# EasyEDA Pro project 18650Charger.epro

# Schematic Schematic1
Create Date: 2022-09-24; Page Name: P1; Project Name: 18650锂电池充电模块; Schematic Name: Schematic1; Update Date: 2022-10-14; Company: 嘉立创EDA
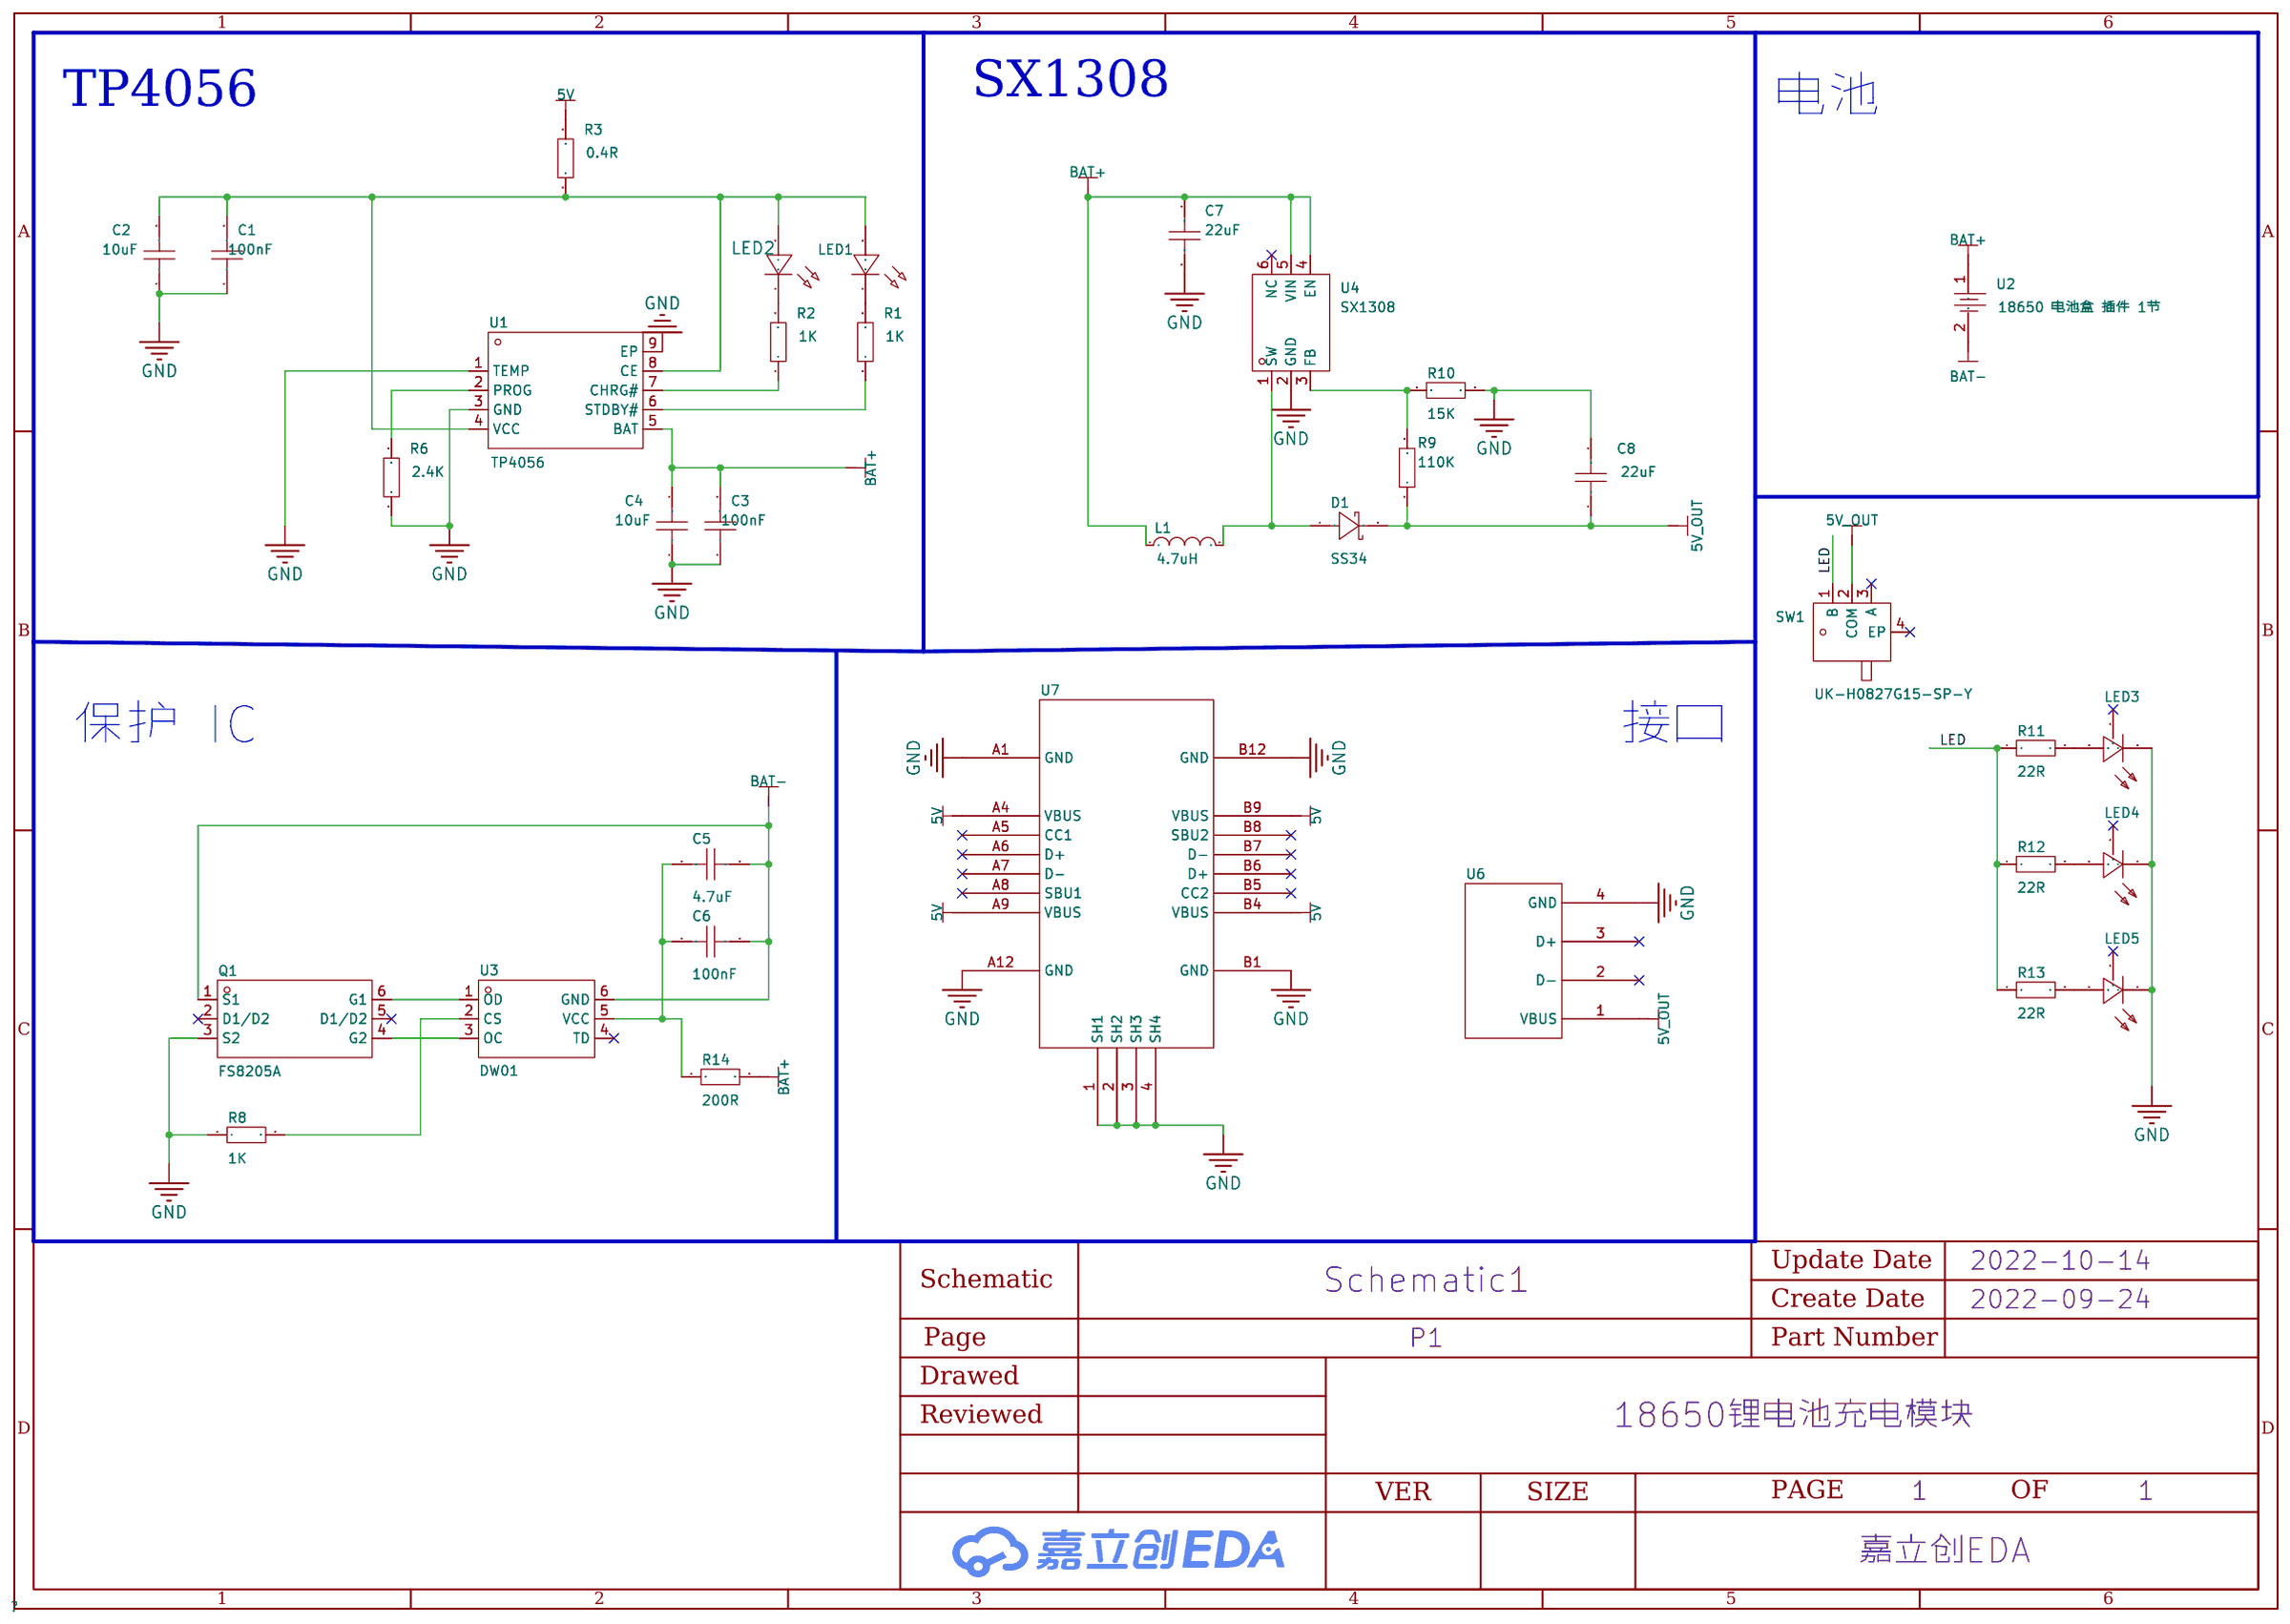
[diagram p0: schematic sheet]

## Parts
C1  100nF  [C0805]
C2  100nF  [C0805]
C3  100nF  [C0805]
C4  100nF  [C0805]
C5  100nF  [C0603]
C6  100nF  [C0603]
C7  100nF  [C0603]
C8  100nF  [C0603]
D1  SS34  [SMA_L4.3-W2.5-LS5.0-FD]
L1  4.7uH  [IND-SMD_L7.4-W6.6]
LED1  -  [LED0805-RD_RED]
LED2  -  [LED0805-RD_RED]
LED3  HL-A-5730D34W-S1-08-HR3(LY)  [LED-SMD_3P-L5.7-W3.0-RD]
LED4  HL-A-5730D34W-S1-08-HR3(LY)  [LED-SMD_3P-L5.7-W3.0-RD]
LED5  HL-A-5730D34W-S1-08-HR3(LY)  [LED-SMD_3P-L5.7-W3.0-RD]
Q1  FS8205A  [SOT-23-6_L2.9-W1.6-P0.95-LS2.8-BR]
R1  10K  [R0603]
R2  10K  [R0603]
R3  10K  [R0603]
R6  10K  [R0603]
R8  10K  [R0603]
R9  10K  [R0603]
R10  10K  [R0603]
R11  10K  [R0603]
R12  10K  [R0603]
R13  10K  [R0603]
R14  10K  [R0603]
SW1  UK-H0827G15-SP-Y  [SW-SMD_UK-H0827G15-SP-Y]
U1  TP4056  [ESOP-8_L4.9-W3.9-P1.27-LS6.0-BL-EP]
U2  18650 电池盒 插件 1节  [BAT-TH_18650-C9900004923]
U3  DW01  [SOT-23-6_L2.9-W1.6-P0.95-LS2.8-BR]
U4  SX1308  [SOT-23-6_L2.9-W1.6-P0.95-LS2.8-BR]
U6  -  [USB-A Short]
U7  -  [TypeC-16p]

## Library data of the parts
C1-C4 = CAP_0805: 容值:100nF;精度:±10%;额定电压:50V;温度系数:X7R;; Supplier Footprint: 0805
C5-C8 = CAP_0603: Supplier Footprint: 0603
D1 = SS34: 二极管配置:独立式;直流反向耐压(Vr):40V;平均整流电流(Io):3A;正向压降(Vf):550mV@3A;反向电流(Ir):500A@40V;; LCSC Part Name: 40V 3A 550mV@3A; Supplier Part: C2931787; Manufacturer: Doeshare(德芯); Supplier Footprint: SMA; JLCPCB Part Class: 扩展库; Datasheet: https://atta.szlcsc.com/upload/public/pdf/source/20220105/EDEF617DBB50E389FEB58D03748E8B49.pdf; Supplier: LCSC; Diode Configuration: 独立式; Reverse Voltage (Vr): 40V; Average Rectified Current (Io): 3A; Forward Voltage (Vf@If): 550mV@3A; Reverse Leakage Current (Ir): 500A@40V
L1 = CKST0603-4.7uH/M: LCSC Part Name: SMD 一体贴片电感4.7uH±20%; Supplier Part: C3002636; Manufacturer: CENKER(岑科); Supplier Footprint: SMD,7.4x6.6x3mm; JLCPCB Part Class: 扩展库; Datasheet: https://atta.szlcsc.com/upload/public/pdf/source/20220510/B48FE89972EB9627500571FF6CB43AFA.pdf; Supplier: LCSC
LED1 = LED_0805-G: Supplier Footprint: 0805
LED2 = LED_0805-R: Supplier Footprint: 0805
LED3-LED5 = HL-A-5730D34W-S1-08-HR3(LY): 发光颜色:白灯;二极管配置:-;透镜颜色:雾状黄;主波长:-;峰值波长:-;色温:-;光通量(25时):-;测试电流:-;正向电压(VF):-;发光强度:-;功率:612mW;发光角度:120°;安装方式:正贴;工作温度:-40~+85;; LCSC Part Name: 白灯 正贴; Supplier Part: C210354; Manufacturer: HONGLITRONIC(鸿利光电); Supplier Footprint: 5730(mm); JLCPCB Part Class: 扩展库; Datasheet: https://atta.szlcsc.com/upload/public/pdf/source/20200902/C210350_91D2B1C221EBF980B384078881E60407.pdf; Supplier: LCSC; Emitted Color: 白灯; Lens Color: 雾状黄; Power Dissipation: 612mW; Viewing Angle: 120°; Mounting Sytle: 正贴; Operating Temperature: -40~+85
Q1 = FS8205A: 类型:2个N沟道;漏源电压(Vdss):20V;连续漏极电流(Id):6A;功率(Pd):1.5W;导通电阻(RDS(on)@Vgs,Id):19.5mΩ@4.5V,3A;阈值电压(Vgs(th)@Id):700mV@250uA;栅极电荷(Qg@Vgs):5.7nC@10V;输入电容(Ciss@Vds):466pF@10V;反向传输电容(Crss@Vds):58pF@10V;工作温度:-55~+150@(Tj);; LCSC Part Name: 2个N沟道 20V 6A; Supplier Part: C2830320; Manufacturer: TECH PUBLIC(台舟); Supplier Footprint: SOT-23-6; JLCPCB Part Class: 扩展库; Datasheet: https://atta.szlcsc.com/upload/public/pdf/source/20210810/F53B6D4E8755A1F8E11BAF814CE98E6A.pdf; Supplier: LCSC; Type: 2个N沟道; Drain Source Voltage (Vdss): 20V; Continuous Drain Current (Id): 6A; Power Dissipation (Pd): 1.5W; Drain Source On Resistance (RDS(on)@Vgs,Id): 19.5mΩ@4.5V,3A; Gate Threshold Voltage (Vgs(th)@Id): 700mV@250uA; Total Gate Charge (Qg@Vgs): 5.7nC@10V; Input Capacitance (Ciss@Vds): 466pF@10V; Reverse Transfer Capacitance (Crss@Vds): 58pF@10V; Operating Temperature: -55~+150@(Tj)
R1-R3 R6 R8-R14 = Res_0603: Supplier Footprint: 0603
SW1 = UK-H0827G15-SP-Y: 电路结构:-;开关功能:-;额定电压 DC:-;触点额定电流:-;额定电压 AC:-;; LCSC Part Name: 拨动开关6.6x2.6 7脚小拨动侧拨贴片; Supplier Part: C493292; Manufacturer: USAKRO(美韩); Supplier Footprint: SMD; JLCPCB Part Class: 扩展库; Datasheet: https://atta.szlcsc.com/upload/public/pdf/source/20200316/C493292_53A710CCBEF69A25529F79D71BD65D07.pdf; Supplier: LCSC
U1 = TP4056_C725790: Supplier Part: C725790; Manufacturer: UMW(友台半导体); Supplier Footprint: ESOP-8; JLCPCB Part Class: 扩展库; Datasheet: https://atta.szlcsc.com/upload/public/pdf/source/20211011/37515E71BA298E23D23475482C49633D.pdf; Supplier: LCSC
U2 = 18650 电池盒 插件 1节: Supplier Part: C9900004923; Supplier Footprint: BAT_TH_2P-L77.7-W20.9-P55.61; JLCPCB Part Class: 扩展库; Datasheet: https://atta.szlcsc.comnull; Supplier: LCSC
U3 = DW01: 充电电池的类型:-;电池单元组数:-;最大充电电流:-;充满的电池组电压:-;最大供应电压:-;; Supplier Part: C700964; Manufacturer: HUASHUO(华朔); Supplier Footprint: SOT-23-6; JLCPCB Part Class: 扩展库; Datasheet: https://atta.szlcsc.com/upload/public/pdf/source/20210303/C700964_5F3D14DF7BC21BAB92657A6D6F0C1F71.pdf; Supplier: LCSC
U4 = SX1308: 功能类型:升压型;同步整流:否;输出通道数:1;拓扑结构:升压式;输入电压:2V~24V;输出电压:28V;输出电流(最大值):-;开关频率:1.2MHz;; LCSC Part Name: 升压型 2V~24V 1.2MHz; Supplier Part: C78162; Manufacturer: SX(硕芯科技); Supplier Footprint: SOT-23-6; JLCPCB Part Class: 扩展库; Datasheet: https://atta.szlcsc.com/upload/public/pdf/source/20160920/1474356679185.pdf; Supplier: LCSC; Function: 升压型; Synchronous Rectification: 否; Number of Outputs: 1; Topology: 升压式; Input Voltage: 2V~24V; Output Voltage: 28V; Switching Frequency: 1.2MHz
U6 = USB-A Short
U7 = TypeC-16P

## Nets
5V: R3.2 U7.A4(VBUS) U7.A9(VBUS) U7.B4(VBUS) U7.B9(VBUS)
5V_OUT: C8.1 D1.2(K) R9.1 SW1.2(COM) U6.1(VBUS)
GND: C1.1 C2.1 C3.1 C4.1 C7.1 C8.2 LED3.1 LED4.1 LED5.1 Q1.3(S2) R6.1 R8.1 R10.2 U1.1(TEMP) U1.3(GND) U1.9(EP) U4.2(GND) U6.4(GND) U7.1(SH1) U7.2(SH2) U7.3(SH3) U7.4(SH4) U7.A1(GND) U7.A12(GND) U7.B1(GND) U7.B12(GND)
BAT+: C3.2 C4.2 C7.2 L1.1 R14.2 U1.5(BAT) U2.1 U4.4(EN) U4.5(VIN)
BAT-: C5.2 C6.2 Q1.1(S1) U2.2 U3.6(GND)
LED: R11.1 R12.1 R13.1 SW1.1(B)
$1N416: LED1.1(C) R1.2
$1N485: LED2.1(C) R2.2
$1N488: R2.1 U1.7(CHRG#)
$1N492: R1.1 U1.6(STDBY#)
$1N1102: R6.2 U1.2(PROG)
$1N1373: C1.2 C2.2 LED1.2(A) LED2.2(A) R3.1 U1.4(VCC) U1.8(CE)
$1N6097: Q1.6(G1) U3.1(OD)
$1N6746: Q1.4(G2) U3.3(OC)
$1N6784: R8.2 U3.2(CS)
$1N7976: D1.1(A) L1.2 U4.1(SW)
$1N8392: R9.2 R10.1 U4.3(FB)
$1N14501: LED3.2 R11.2
$1N14696: LED5.2 R13.2
$1N14727: LED4.2 R12.2
$1N17485: C5.1 C6.1 R14.1 U3.5(VCC)

Not connected (* = marked no-connect by the designer): LED3 3*; LED4 3*; LED5 3*; Q1 2(D1/D2)* 5(D1/D2)*; SW1 3(A)* 4(EP)*; U3 4(TD)*; U4 6(NC)*; U6 2(D-)* 3(D+)*; U7 A5(CC1)* A6(D+)* A7(D-)* A8(SBU1)* B5(CC2)* B6(D+)* B7(D-)* B8(SBU2)*

## Notes on the sheet
- SX1308
- TP4056
- 电池
- 保护 IC
- 接口

# Board PCB1
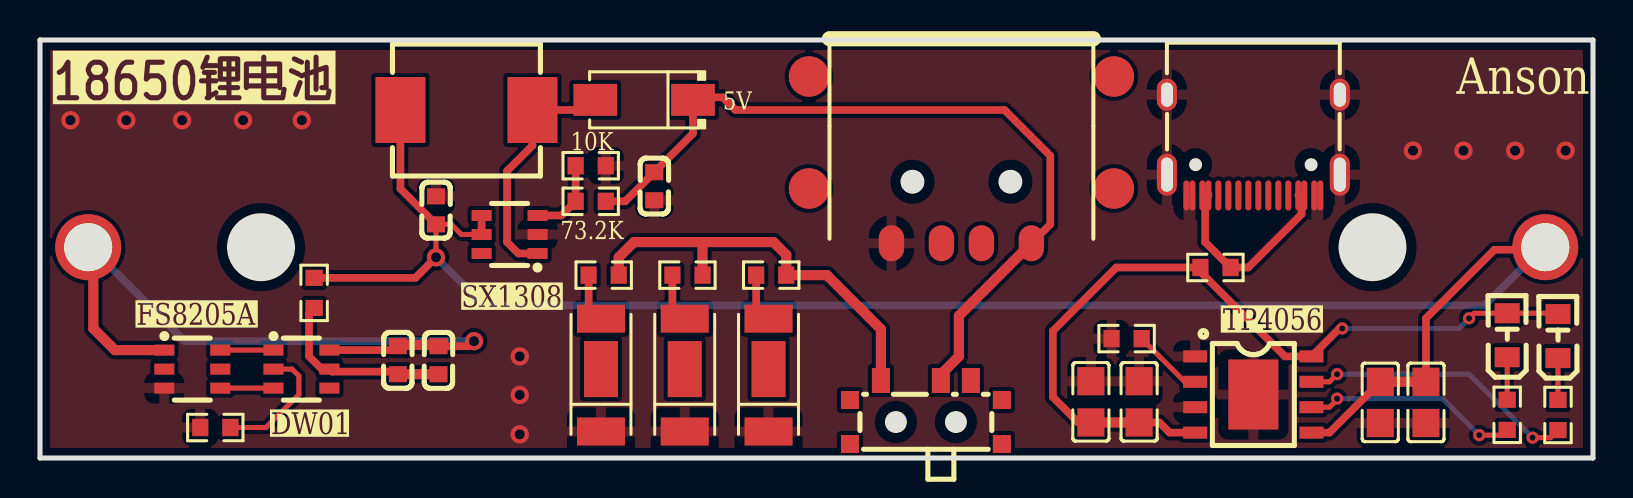
[diagram p1: board, top side]
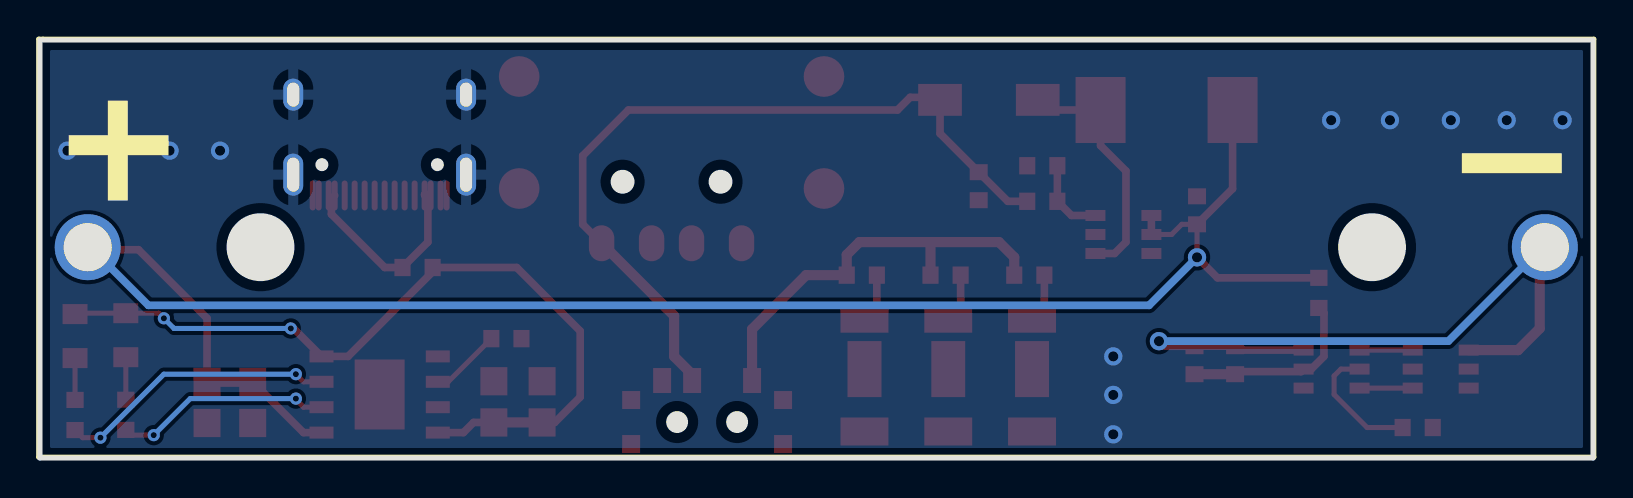
[diagram p2: board, bottom side, seen from below]

Outline 77.7 x 20.9 mm; copper layers: Top Layer, Bottom Layer. Coordinates in mm from the lower left corner of the outline.
Outline path: 0,20.9 77.7,20.9 77.7,0 0,0 0,20.9
Stack: Top Layer 0.035mm / Dielectric1 1.51mm FR4 er 4.5 / Bottom Layer 0.035mm

## Design rules (mm)
spacing safeClearance (default): track to track 0.152, other pairs 0.152 to 0.3
track width trackWidth (default): min 0.127, default 0.254, max 2.54
differential pair differentialPair (default): width min 0.127, default 0.254, max 2.54; gap min 0.152, default 0.152
via viaSize (default): diameter min 0.5, default 0.61, max 10; hole min 0.3, default 0.305, max 6

## Placement (name value [footprint] x y rotation side)
C1  100nF  [C0805]  52.58 2.81 270 top
C2  100nF  [C0805]  54.99 2.81 270 top
C3  100nF  [C0805]  69.34 2.78 90 top
C4  100nF  [C0805]  67.06 2.78 90 top
C5  100nF  [C0603]  17.91 4.89 90 top
C6  100nF  [C0603]  19.94 4.89 90 top
C7  100nF  [C0603]  19.81 12.38 270 top
C8  100nF  [C0603]  30.73 13.59 270 top
D1  SS34  [SMA_L4.3-W2.5-LS5.0-FD]  30.23 17.91 0 top
L1  4.7uH  [IND-SMD_L7.4-W6.6]  21.34 17.4 0 top
LED1  -  [LED0805-RD_RED]  73.41 6.14 90 top
LED2  -  [LED0805-RD_RED]  75.95 6.1 90 top
LED3  HL-A-5730D34W-S1-08-HR3(LY)  [LED-SMD_3P-L5.7-W3.0-RD]  36.45 4.14 90 top
LED4  HL-A-5730D34W-S1-08-HR3(LY)  [LED-SMD_3P-L5.7-W3.0-RD]  32.26 4.14 90 top
LED5  HL-A-5730D34W-S1-08-HR3(LY)  [LED-SMD_3P-L5.7-W3.0-RD]  28.07 4.14 90 top
Q1  FS8205A  [SOT-23-6_L2.9-W1.6-P0.95-LS2.8-BR]  7.62 4.44 180 top
R1  10K  [R0603]  73.41 2.16 90 top
R2  10K  [R0603]  75.95 2.15 90 top
R3  10K  [R0603]  58.81 9.53 0 top
R6  10K  [R0603]  54.36 5.97 0 top
R8  10K  [R0603]  8.77 1.52 0 top
R9  10K  [R0603]  27.55 12.83 180 top
R10  10K  [R0603]  27.55 14.61 0 top
R11  10K  [R0603]  36.58 9.14 180 top
R12  10K  [R0603]  32.39 9.14 180 top
R13  10K  [R0603]  28.2 9.14 180 top
R14  10K  [R0603]  13.72 8.25 90 top
SW1  UK-H0827G15-SP-Y  [SW-SMD_UK-H0827G15-SP-Y]  44.32 2.29 0 top
U1  TP4056  [ESOP-8_L4.9-W3.9-P1.27-LS6.0-BL-EP]  60.71 3.17 270 top
U2  18650 电池盒 插件 1节  [BAT-TH_18650-C9900004923]  38.86 10.54 180 bottom
U3  DW01  [SOT-23-6_L2.9-W1.6-P0.95-LS2.8-BR]  13.08 4.44 180 top
U4  SX1308  [SOT-23-6_L2.9-W1.6-P0.95-LS2.8-BR]  23.5 11.18 0 top
U6  -  [USB-A Short]  46.1 15.75 90 top
U7  -  [TypeC-16p]  60.71 16.64 90 top

## Footprints (pads in the part's own frame, mm; a bottom-side part is the same pattern mirrored in y, then rotated)
BAT-TH_18650-C9900004923
  round 3.3 hole 2.4: 1(-36.45,0) 2(36.45,0)
C0603
  rect 0.8x0.9 smd: 1(-0.7,0) 2(0.7,0)
C0805
  rect 1.41x1.35 smd: 1(-1.03,0) 2(1.03,0)
ESOP-8_L4.9-W3.9-P1.27-LS6.0-BL-EP
  rect 0.6x1.2 smd: 1(-1.905,-2.909) 2(-0.635,-2.909) 3(0.635,-2.909) 4(1.905,-2.909) 5(1.905,2.909) 6(0.635,2.909) 7(-0.635,2.909) 8(-1.905,2.909)
  rect 3.5x2.5 smd: 9(0,0)
IND-SMD_L7.4-W6.6
  rect 2.499x3.3 smd: 1(-3.302,0) 2(3.302,0)
LED0805-RD_RED
  rect 1x1.25 smd: 1(-1.1,0) 2(1.1,0)
LED-SMD_3P-L5.7-W3.0-RD
  rect 1.4x2.4 smd: 1(-2.82,0) 2(2.82,0)
  rect 2.8x1.7 smd: 3(0.3,0)
R0603
  rect 0.806x0.864 smd: 1(-0.753,0) 2(0.753,0)
SMA_L4.3-W2.5-LS5.0-FD
  rect 2.184x1.593 smd: 1(-2.443,0) 2(2.443,0)
SOT-23-6_L2.9-W1.6-P0.95-LS2.8-BR
  rect 1x0.55 smd: 1(1.4,-0.95) 2(1.4,0) 3(1.4,0.95) 4(-1.4,0.95) 5(-1.4,0) 6(-1.4,-0.95)
SW-SMD_UK-H0827G15-SP-Y
  rect 0.899x1.25 smd: 1(-2.251,1.587) 2(0.75,1.587) 3(2.251,1.587)
  rect 0.899x0.899 smd: 4(-3.8,0.612) 4(-3.8,-1.587) 4(3.8,0.612) 4(3.8,-1.587)
TypeC-16p
  oval 2.1x1 hole 1.7x0.6: 1(-2.47,-4.325) 4(-2.47,4.325)
  oval 1.6x1 hole 1.2x0.6: 2(1.53,-4.325) 3(1.53,4.325)
  rrect 1.5x0.3 smd: A1(-3.51,-3.35) A4(-3.51,-2.55) A5(-3.51,-1.25) A6(-3.51,-0.25) A7(-3.51,0.25) A8(-3.51,1.25) A9(-3.51,2.55) A12(-3.51,3.35) B1(-3.51,3.05) B4(-3.51,2.25) B5(-3.51,1.75) B6(-3.51,0.75) B7(-3.51,-0.75) B8(-3.51,-1.75) B9(-3.51,-2.25) B12(-3.51,-3.05)
USB-A Short
  rrect 2.032x2.032 smd: 0(-2.273,7.625) 0(-2.273,-7.625) 0(3.327,7.625) 0(3.327,-7.625)
  rrect 1.8x1.27 smd: 1(-5.011,-3.5) 2(-5.011,-1) 3(-5.011,1) 4(-5.011,3.5)

## Nets
As in the schematic.

Pads without a net: LED3 3; LED4 3; LED5 3; Q1 2 5; SW1 3 4; U3 4; U4 6; U6 0 2 3; U7 A5 A6 A7 A8 B5 B6 B7 B8

## Via types
v1: diameter 0.914, hole 0.508, Top Layer to Bottom Layer, 14 vias
v2: diameter 0.61, hole 0.305, Top Layer to Bottom Layer, 6 vias

## Routing (per net, layer and track width the routed paths; a pad name or vN(x,y) marks a point on that pad's centre or on a via; arc(x,y) is an arc through that point)
5V: length 10
  Top Layer w0.381: U7.B9 63.12,12.96 63.12,12.19 60.45,9.53 R3.2 58.29,10.8 58.29,13.08 58.42,13.21 58.46,13.17 U7.B4
5V_OUT: length 40.3
  Top Layer w0.381: 32.42,18.03 34.16,18.03 34.8,17.4 48.26,17.4 50.55,15.11 50.55,11.68 49.6,10.74 ; R9.1 29.28,12.83 C8.1 32.67,16.22 D1.2
  Top Layer w0.508: SW1.2 45.07,4.18 45.97,5.08 45.97,7.11 49.6,10.74
GND:
  vias: v1(1.52,16.89) v1(4.32,16.89) v1(7.11,16.89) v1(10.16,16.89) v1(13.1,16.89) v1(24,5.08) v1(24,3.15) v1(24,1.18) v1(68.69,15.37) v1(71.22,15.37) v1(73.8,15.37) v1(76.33,15.37)
BAT+: length 93.2
  Top Layer w0.254: v1(19.81,10.03) C7.2 20.57,11.68 21.08,11.18 U4.5
  Top Layer w0.381: U1.5 64.52,1.27 C4.2 ; R14.2 18.79,9.01 v1(19.81,10.03) ; L1.1 18.03,13.46 C7.2 ; U2.1 75.19,10.41 72.77,10.41 69.34,6.98 C3.2 ; U4.5 U4.4
  Top Layer w0.508: C4.2 C3.2
  Bottom Layer w0.381: 75.31,10.67 72.28,7.63 22.21,7.63 v1(19.81,10.03)
BAT-: length 37.1
  Top Layer w0.381: C6.2 21.46,5.59 v1(21.72,5.84) ; 14.48,5.39 17.52,5.39 17.78,5.65
  Top Layer w0.508: 17.78,5.65 19.87,5.65 C6.2 ; 2.41,10.67 2.67,10.41 2.67,6.48 3.75,5.39 Q1.1
  Bottom Layer w0.381: v1(21.72,5.84) 7.24,5.84 2.41,10.67
LED: length 20.9
  Top Layer w0.508: 33.16,10.8 36.7,10.8 37.34,10.16 R11.1 39.37,9.14 42.07,6.44 SW1.1 ; 33.16,10.8 29.72,10.8 28.96,10.03 R13.1 ; 33.16,10.8 33.15,10.78 R12.1
$1N416: length 2.1
  Top Layer w0.254: R1.2 LED1.1
$1N485: length 2.1
  Top Layer w0.254: LED2.1 R2.2
$1N488: length 14
  Top Layer w0.254: v2(74.68,1.02) 75.56,1.02 R2.1 ; U1.7 64.52,3.81 v2(64.9,4.19)
  Bottom Layer w0.254: v2(74.68,1.02) 71.5,4.19 v2(64.9,4.19)
$1N492: length 10.8
  Top Layer w0.254: R1.1 73.14,1.14 v2(72.01,1.14) ; 64.9,2.92 64.52,2.54 U1.6
  Bottom Layer w0.254: v2(72.01,1.14) 70.18,2.97 v2(64.9,2.97)
$1N1102: length 3.6
  Top Layer w0.254: R6.2 57.28,3.81 U1.2
$1N1373: length 40.6
  Top Layer w0.254: LED2.2 75.9,7.24 71.75,7.24 v2(71.5,6.98)
  Top Layer w0.381: C1.2 51.94,1.78 50.67,3.05 50.67,6.35 53.85,9.53 R3.1 58.06,9.31 62.29,5.08 U1.8 65.01,6.48 v2(65.15,6.48) ; C2.2 56.01,1.78 56.51,1.27 U1.4
  Top Layer w0.508: C1.2 C2.2
  Bottom Layer w0.254: v2(71.5,6.98) 70.99,6.48 v2(65.15,6.48)
$1N6097: length 2.7
  Top Layer w0.254: Q1.6 U3.1
$1N6746: length 2.7
  Top Layer w0.254: 9.02,3.5 11.68,3.5
$1N6784: length 6.5
  Top Layer w0.254: R8.2 11.3,1.52 12.95,3.17 12.95,4.1 12.61,4.44 U3.2
$1N7976: length 12.2
  Top Layer w0.381: D1.1 27.27,17.4 L1.2 24.64,15.62 23.37,14.35 23.37,10.8 23.94,10.23 U4.1
$1N8392: length 4
  Top Layer w0.381: R10.1 R9.2 26.09,12.13 U4.3
$1N14501: length 2.4
  Top Layer w0.381: LED3.2 35.83,7.58 R11.2
$1N14696: length 2.4
  Top Layer w0.381: LED5.2 27.45,7.58 27.45,9.14
$1N14727: length 2.4
  Top Layer w0.381: LED4.2 31.64,7.58 R12.2
$1N17485: length 9.4
  Top Layer w0.254: 19.94,4.19 C6.1
  Top Layer w0.381: R14.1 13.46,7.25 13.46,5.08 14.1,4.44 14.48,4.44 14.61,4.32 17.78,4.32 C5.1
  Top Layer w0.508: C5.1 19.94,4.19

## Copper pours and planes (outline as drawn; the poured copper is in the pictures)
GND on Top Layer: -0.04,20.94 77.76,20.94 77.76,0.04 -0.04,0.04
GND on Bottom Layer: -0.04,20.94 77.76,20.94 77.76,0.04 -0.04,0.04

## Text on the board
Top Silkscreen Layer: 73.2K | 10K | 5V | FS8205A | DW01 | SX1308 | TP4056 | 18650锂电池 | Anson
